# Altium schematic sheet Coilgun.SchDoc
size A4
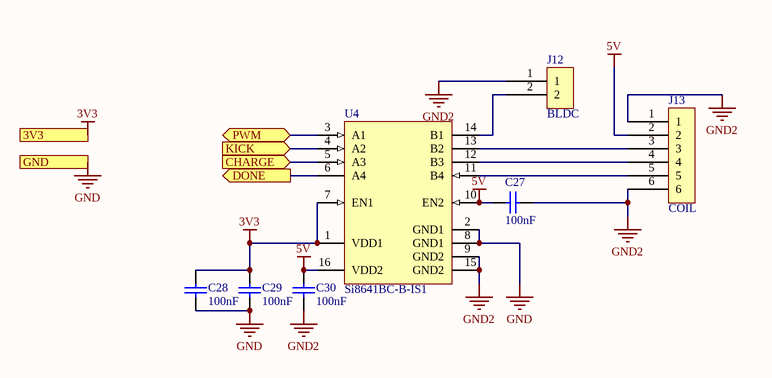
[diagram p0: Coilgun.SchDoc]

## Parts
C27  100nF  [CAPC0603(1608)100_L]
C28  100nF  [CAPC0603(1608)100_L]
C29  100nF  [CAPC0603(1608)100_L]
C30  100nF  [CAPC0603(1608)100_L]
J12  BLDC  [PIN-HEADER-2]
J13  COIL  [MICRO-MATCH-6]
U4  Si8641BC-B-IS1  [SLAB-SOIC-16-NB_L]

## Ports
3V3, CHARGE (in), DONE (out), GND, KICK (in), PWM

## Nets
3V3: C28.2 C29.1 U4.1(VDD1) U4.7(EN1) ; port 3V3
5V: C27.2 C30.1 J13.2 U4.10(EN2) U4.16(VDD2)
GND: C28.1 C29.2 U4.2(GND1) U4.8(GND1) ; port GND
GND2: C27.1 C30.2 J12.1 J13.1 J13.6 U4.9(GND2) U4.15(GND2)
CHARGE: U4.5(A3) ; port CHARGE
DONE: U4.6(A4) ; port DONE
KICK: U4.4(A2) ; port KICK
PWM: U4.3(A1) ; port PWM
NetJ12_2: J12.2 U4.14(B1)
NetJ13_3: J13.3 U4.13(B2)
NetJ13_4: J13.4 U4.12(B3)
NetJ13_5: J13.5 U4.11(B4)

## Library data of the parts
C27-C30 = CMP-1035-02579-1: CAP 100nF 10V ±5% 0603 (1608 Metric) Thickness 1mm SMD; Tolerance: Â±5%; Case-EIA: 0603; Case-Metric: 1608; Value: 100nF; Max Thickness: 1 mm; Rated Voltage: 10 V; Technology: SMT
J12 = HEADER-2
J13 = HEADER-6
U4 = CMP-0512-00190-1: Low-Power Quad-Channel Digital Isolator, 150 Mbps, 3.75 kVRMS Isolation Rating, -40 to 125 degC, 16-pin SOIC; Manufacturer: Silicon Labs; Maximum Data Rate (Mbps): 150; Maximum Propagation Delay (ns): 13; Sub-Family: Isolators; Enable Control: TRUE; Isolation Rating (kV): 3.75; Channel Type: Unidirectional; 10kV surge: FALSE; Code_IPC: J-STD-020; ComponentLink1URL: http://www.silabs.com/; ComponentLink1Description: Manufacturer URL; DatasheetVersion: Rev. 1.5; Code_JEDEC: MS-012; ComponentLink2Description: Datasheet; PackageDescription: 16-Pin Small-Outline Integrated Circuit, Body 9.9 x 3.9 mm, Pitch 1.27 mm; ComponentLink3URL: http://www.silabs.com/Support%20Documents/TechnicalDocs/si2401.pdf; ComponentLink2URL: http://www.silabs.com/Support%20Documents/TechnicalDocs/Si864x.pdf; PackageReference: SOIC-16-NB; PartNumber: Si8641BC-B-IS1; ComponentLink3Description: Package Specification; Mounting Technology: Surface Mount; AEC-Q100: FALSE